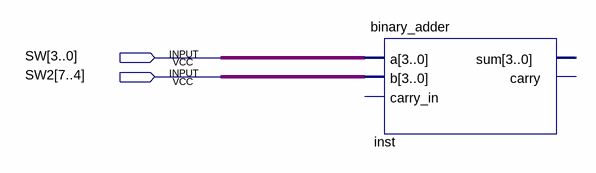
[diagram p0: schematic sheet]
// Quartus schematic Block1.bdf as structural Verilog: 1 symbols, 2 pins
module Block1 (
  input  [3:0] SW,
  input  [7:4] SW2
);

  binary_adder inst (.a(SW), .b(SW2));  // open: carry_in, sum, carry
endmodule
